# EAGLE schematic SuperDuperServoController (EAGLE 7.1.0)
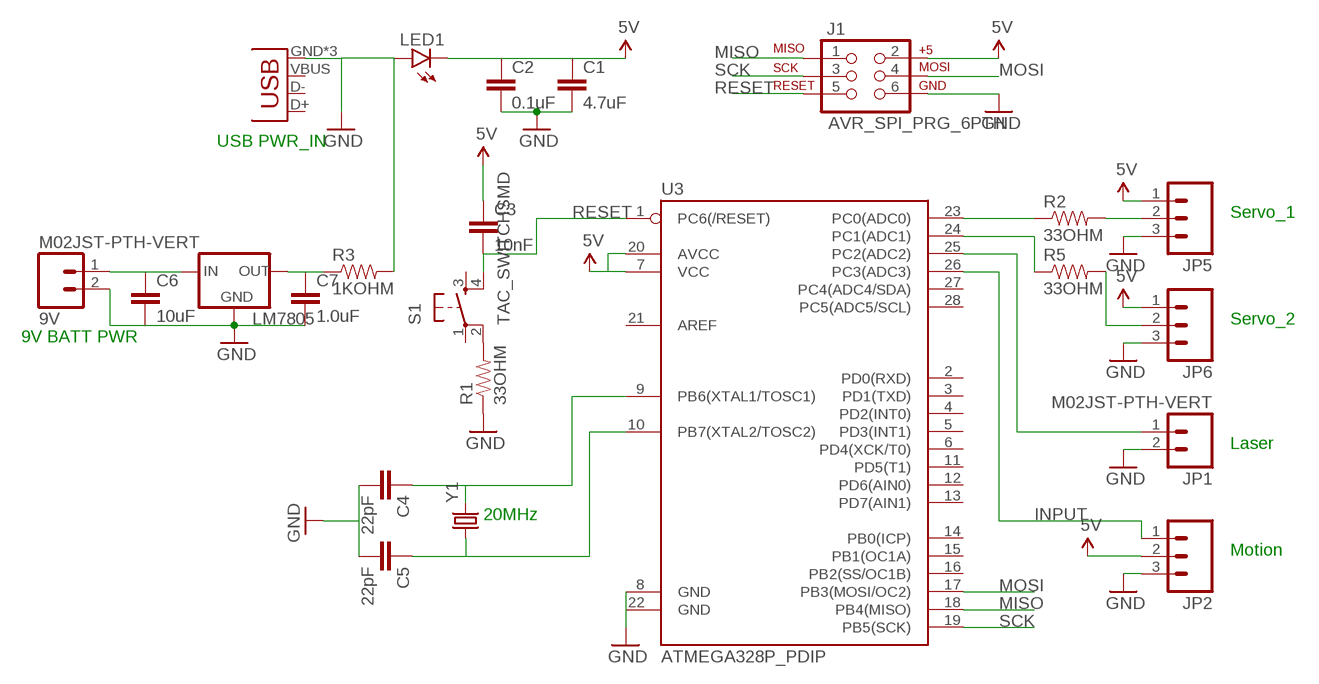
[diagram p0: schematic, sheet 1]

## Parts
9V  M02JST-PTH-VERT  [JST-2-PTH-VERT]
C1  4.7uF  4.7UF-6.3V-10%(0603)0603  [0603-CAP]
C2  0.1uF  0.1UF-25V(+80/-20%)(0603)  [0603-CAP]
C3  10nF  10NF/10000PF-50V-10%(0603)  [0603-CAP]
C4  22pF  4.7UF-6.3V-10%(0603)0603  [0603-CAP]
C5  22pF  4.7UF-6.3V-10%(0603)0603  [0603-CAP]
C6  10uF  1.0UF-16V-10%(0402)  [0402-CAP]
C7  1.0uF  1.0UF-16V-10%(0402)  [0402-CAP]
J1  AVR_SPI_PRG_6PTH  [2X3]
JP1  M02JST-PTH-VERT  [JST-2-PTH-VERT]
JP2  M03JST-PTH-VERT  [JST-3-PTH-VERT]
JP4  USB-MICROB  [USB-MICROB]
JP5  M03JST-PTH-VERT  [JST-3-PTH-VERT]
JP6  M03JST-PTH-VERT  [JST-3-PTH-VERT]
LED1  LED-3MM-NO_SILK  [LED3MM-NS]
LM7805  V_REG_78XXSIDE  [78XXL]
R1  33OHM  33OHM1/10W1%(0603)  [0603]
R2  33OHM  33OHM1/10W1%(0603)  [0603]
R3  1KOHM  33OHM1/10W1%(0603)  [0603]
R5  33OHM  33OHM1/10W1%(0603)  [0603]
S1  TAC_SWITCHSMD  [TACTILE-SWITCH-SMD]
U3  ATMEGA328P_PDIP  [DIL28-3]
Y1  CRYSTAL10.5X4.8  [CRYSTAL-SMD-10.5X4.8-2PIN]

## Nets
5V: C3.1 J1.2 JP2.2 JP5.1 JP6.1 LED1.K(C) U3.7(VCC) U3.20(AVCC)
GND: 9V.2 C1.2 C2.2 C4.2 C5.2 C7.2 J1.6 JP1.2 JP2.3 JP4.GND JP4.MT1(GND) JP4.MT2(GND) JP5.3 JP6.3 LED1.A R1.1 R3.2 U3.8(GND)
INPUT: JP2.1 U3.26(PC3(ADC3))
MISO: J1.1 U3.18(PB4(MISO))
MOSI: J1.4 U3.17(PB3(MOSI/OC2))
N$1: R1.2 S1.2
N$2: R2.1 U3.23(PC0(ADC0))
N$3: JP6.2 R5.2
N$4: C5.1 U3.10(PB7(XTAL2/TOSC2)) Y1.P$1
N$5: C4.1 U3.9(PB6(XTAL1/TOSC1)) Y1.P$2
N$6: R5.1 U3.24(PC1(ADC1))
N$7: JP5.2 R2.2
N$8: 9V.1 LM7805.IN
N$9: JP1.1 U3.25(PC2(ADC2))
N$10: LM7805.OUT R3.1
RESET: C3.2 J1.5 S1.4 U3.1(PC6(/RESET))
SCK: J1.3 U3.19(PB5(SCK))
Unconnected: C1.1 C2.1 C6.1 C6.2 C7.1 JP4.D+ JP4.D- JP4.VBUS LM7805.GND S1.1 S1.3 U3.2(PD0(RXD)) U3.3(PD1(TXD)) U3.4(PD2(INT0)) U3.5(PD3(INT1)) U3.6(PD4(XCK/T0)) U3.11(PD5(T1)) U3.12(PD6(AIN0)) U3.13(PD7(AIN1)) U3.14(PB0(ICP)) U3.15(PB1(OC1A)) U3.16(PB2(SS/OC1B)) U3.21(AREF) U3.22(GND) U3.27(PC4(ADC4/SDA)) U3.28(PC5(ADC5/SCL))

## Notes on the sheet
- USB PWR_IN
- Servo_1
- Servo_2
- 9V BATT PWR
- Laser
- 20MHz
- Motion

## Library data of the parts
9V JP1 = SparkFun-Connectors:M02: Standard 2-pin 0.1" header. Use with - straight break away headers ( PRT-00116) - right angle break away headers (PRT-00553) - swiss pins (PRT-00743) - machine pins (PRT-00117) - female headers (PRT-00115) Molex polarized connector foot print use with: PRT-08233 with associated crimp pins and housings. 2.54_SCREWTERM for use with PRT-10571. 3.5mm Screw Terminal footprints for PRT-08084 5mm Screw Terminal footprints for use with PRT-08432
C1 = SparkFun-Capacitors:4.7UF-6.3V-10%(0603): CAP-08280; PROD_ID: CAP-08280
C2 = SparkFun-Capacitors:0.1UF-25V(+80/-20%)(0603): CAP-00810 Ceramic Standard decoupling cap; PROD_ID: CAP-00810
C3 = SparkFun-Capacitors:10NF/10000PF-50V-10%(0603): CAP-00867; PROD_ID: CAP-00867
C4 C5 = SparkFun-Capacitors:4.7UF-6.3V-10%(0603): CAP-08280; PROD_ID: CAP-08280; VALUE: 4.7uF
C6 = SparkFun-Capacitors:1.0UF-16V-10%(0402); PROD_ID: CAP-12417; VALUE: 1.0uF
C7 = SparkFun-Capacitors:1.0UF-16V-10%(0402); PROD_ID: CAP-12417
J1 = SparkFun-Connectors:AVR_SPI_PRG_6: AVR ISP 6 Pin This is the reduced ISP connector for AVR programming. Common on Arduino. This footprint will take up less PCB space and can be used with a 10-pin to 6-pin adapter such as SKU: BOB-08508 **Special note about "TEST_POINT" package. The stop mask is on the top side, so if you want your programming test points to be on the bottom of your board, make sure to place this package on the bottom side of the board. This also ensure that the orientation to program from the bottom side will be correct.
JP2 JP5 JP6 = SparkFun-Connectors:M03: Header 3 Standard 3-pin 0.1" header. Use with straight break away headers (SKU : PRT-00116), right angle break away headers (PRT-00553), swiss pins (PRT-00743), machine pins (PRT-00117), and female headers (PRT-00115). Molex polarized connector foot print use with SKU : PRT-08232 with associated crimp pins and housings.
JP4 = SparkFun-Connectors:USB: USB Connectors USB-B-PTH is fully proven SKU : PRT-00139/CONN-08278 USB-miniB is fully proven SKU : PRT-00587 USB-A-PCB is untested. USB-A-H is throughly reviewed, but untested. Spark Fun Electronics SKU : PRT-00437 USB-B-SMT is throughly reviewed, but untested. Needs silkscreen touching up. USB-A-S has not been used/tested USB-MB-H has not been used/tested USB-MICROB has been used. CONN-09505; PROD_ID: CONN-09505
LED1 = SparkFun-LED:LED: LEDs Standard schematic elements and footprints for 5mm, 3mm, 1206, and 0603 sized LEDs. 5mm - Spark Fun Electronics SKU : COM-00529 (and others)
LM7805 = SparkFun-PowerIC:V_REG_78XX: Voltage Regulator Standard 7805 5V regulator. IGO (Input Ground Output). Spark Fun Electronics SKU : COM-00107
R1 R2 R5 = SparkFun-Resistors:33OHM1/10W1%(0603): RES-08270; PROD_ID: RES-08270
R3 = SparkFun-Resistors:33OHM1/10W1%(0603): RES-08270; PROD_ID: RES-08270; VALUE: 33OHM
S1 = SparkFun-Electromechanical:TAC_SWITCH: Momentary Switch Button commonly used for reset or general input. Spark Fun Electronics SKU : COM-00097 SMT- SWCH-08247; PROD_ID: SWCH-08247
U3 = SparkFun-DigitalIC:ATMEGA328P_PDIP: uC used in the Arduino 32kb flash, 1k EEPROM, 2k SRAM This is the through-hole version of this chip.
Y1 = SparkFun-FreqCtrl:CRYSTAL: Various standard crystals. Proven footprints. Spark Fun Electronics SKU : COM-00534